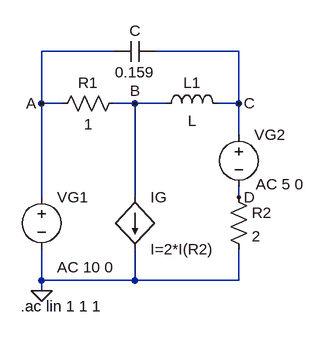
[diagram p0: schematic Draft1.asc]
Draft1.asc, the LTspice schematic file:
Version 4.1
SHEET 1 880 680
WIRE -272 -144 -384 -144
WIRE -80 -144 -208 -144
WIRE -384 -64 -384 -144
WIRE -352 -64 -384 -64
WIRE -240 -64 -272 -64
WIRE -192 -64 -240 -64
WIRE -80 -64 -80 -144
WIRE -80 -64 -112 -64
WIRE -80 -16 -80 -64
WIRE -384 80 -384 -64
WIRE -240 80 -240 -64
WIRE -80 80 -80 64
WIRE -384 208 -384 160
WIRE -240 208 -240 160
WIRE -240 208 -384 208
WIRE -80 208 -80 160
WIRE -80 208 -240 208
WIRE -384 224 -384 208
FLAG -384 224 0
FLAG -384 -64 A
FLAG -240 -64 B
FLAG -80 -64 C
FLAG -80 80 D
SYMBOL voltage -384 64 R0
WINDOW 123 24 124 Left 2
WINDOW 39 0 0 Left 0
SYMATTR InstName VG1
SYMATTR Value ""
SYMATTR Value2 AC 10 0
SYMBOL voltage -80 -32 R0
WINDOW 123 26 92 Left 2
WINDOW 39 0 0 Left 0
SYMATTR InstName VG2
SYMATTR Value ""
SYMATTR Value2 AC 5 0
SYMBOL res -256 -80 R90
WINDOW 0 0 56 VBottom 2
WINDOW 3 32 56 VTop 2
SYMATTR InstName R1
SYMATTR Value 1
SYMBOL res -96 64 R0
SYMATTR InstName R2
SYMATTR Value 2
SYMBOL bi -240 80 R0
SYMATTR InstName IG
SYMATTR Value I=2*I(R2)
SYMBOL ind -208 -48 R270
WINDOW 0 32 56 VTop 2
WINDOW 3 5 56 VBottom 2
SYMATTR InstName L1
SYMATTR SpiceLine Rser=1m
SYMBOL cap -208 -160 R90
WINDOW 0 0 32 VBottom 2
WINDOW 3 32 32 VTop 2
SYMATTR InstName C
SYMATTR Value 0.159
TEXT -416 248 Left 2 !.ac lin 1 1 1

The netlist it stands for:
* Draft1.asc
VG1 A 0 AC 10 0
VG2 C D AC 5 0
R1 B A 1
R2 D 0 2
B§IG B 0 I=2*I(R2)
L1 B C L Rser=1m
C C A 0.159
.ac lin 1 1 1
.backanno
.end